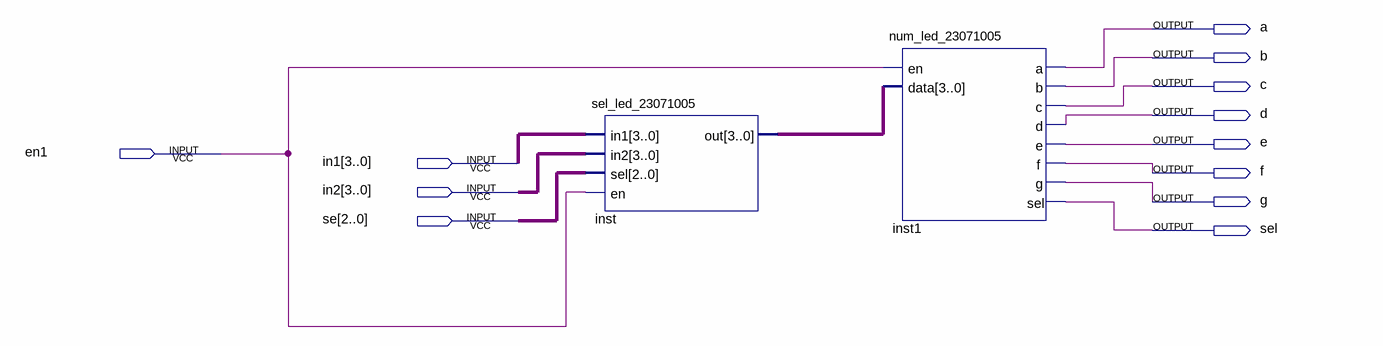
[diagram p0: schematic sheet]
// Quartus schematic task_extra.bdf as structural Verilog: 2 symbols, 12 pins
module task_extra (
  input  en1,
  input  [3:0] in1,
  input  [3:0] in2,
  input  [2:0] se,
  output a,
  output b,
  output c,
  output d,
  output e,
  output f,
  output g,
  output sel
);

  wire [3:0] inst_out;

  sel_led_23071005 inst (.in1(in1), .in2(in2), .sel(se), .en(en1), .out(inst_out));
  num_led_23071005 inst1 (.en(en1), .data(inst_out), .a(a), .b(b), .c(c), .d(d), .e(e), .f(f), .g(g), .sel(sel));
endmodule
